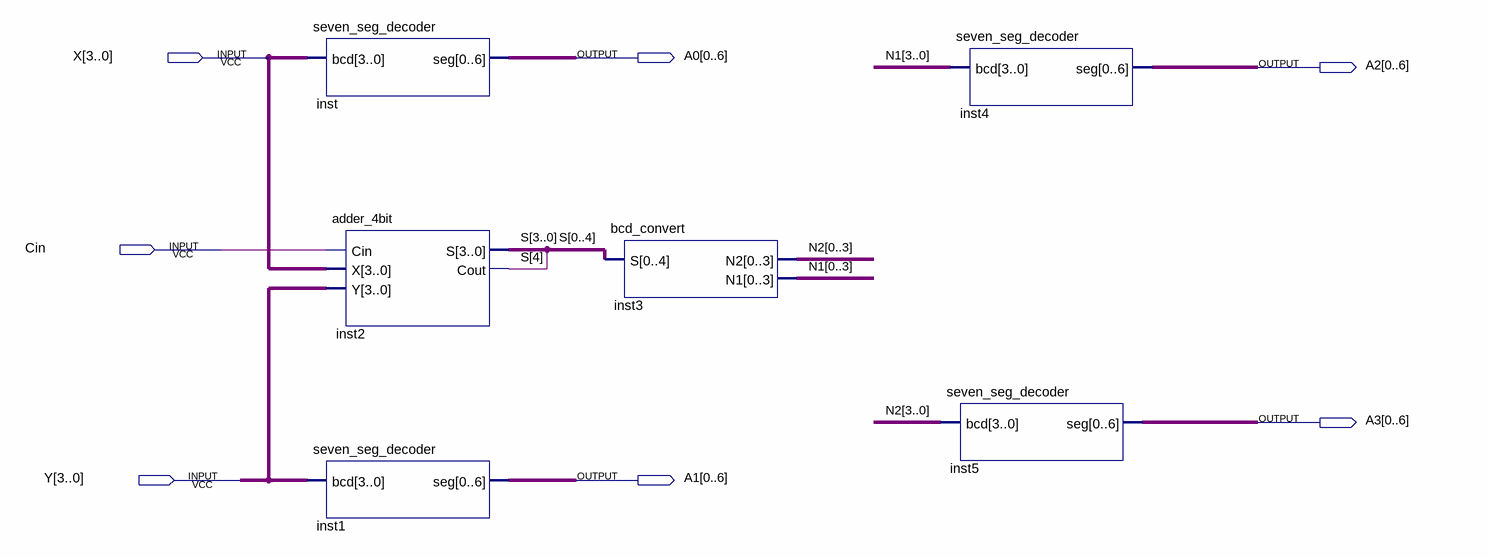
[diagram p0: schematic sheet]
// Quartus schematic lab06.bdf as structural Verilog: 6 symbols, 7 pins
module lab06 (
  input  [3:0] X,
  input  Cin,
  input  [3:0] Y,
  output [0:6] A0,
  output [0:6] A2,
  output [0:6] A3,
  output [0:6] A1
);

  wire [3:0] N1, N2;
  wire [4:0] S;

  seven_seg_decoder inst (.bcd(X), .seg(A0));
  adder_4bit inst2 (.Cin(Cin), .X(X), .Y(Y), .S(S[3:0]), .Cout(S[4]));
  seven_seg_decoder inst1 (.bcd(Y), .seg(A1));
  bcd_convert inst3 (
    .S({S[0], S[1], S[2], S[3], S[4]}), .N2({N2[0], N2[1], N2[2], N2[3]}), .N1({N1[0], N1[1], N1[2], N1[3]}));
  seven_seg_decoder inst4 (.bcd(N1), .seg(A2));
  seven_seg_decoder inst5 (.bcd(N2), .seg(A3));
endmodule
